# EasyEDA Pro project examples.epro, schematic Schematic6
Create Date: 2026-03-05; Page Name: P1; Project Name: EdaCopilotExamples; Schematic Name: Schematic6; Update Date: 2026-03-05; Company: EasyEDA.com; Page Size: A4; Version: V1.0
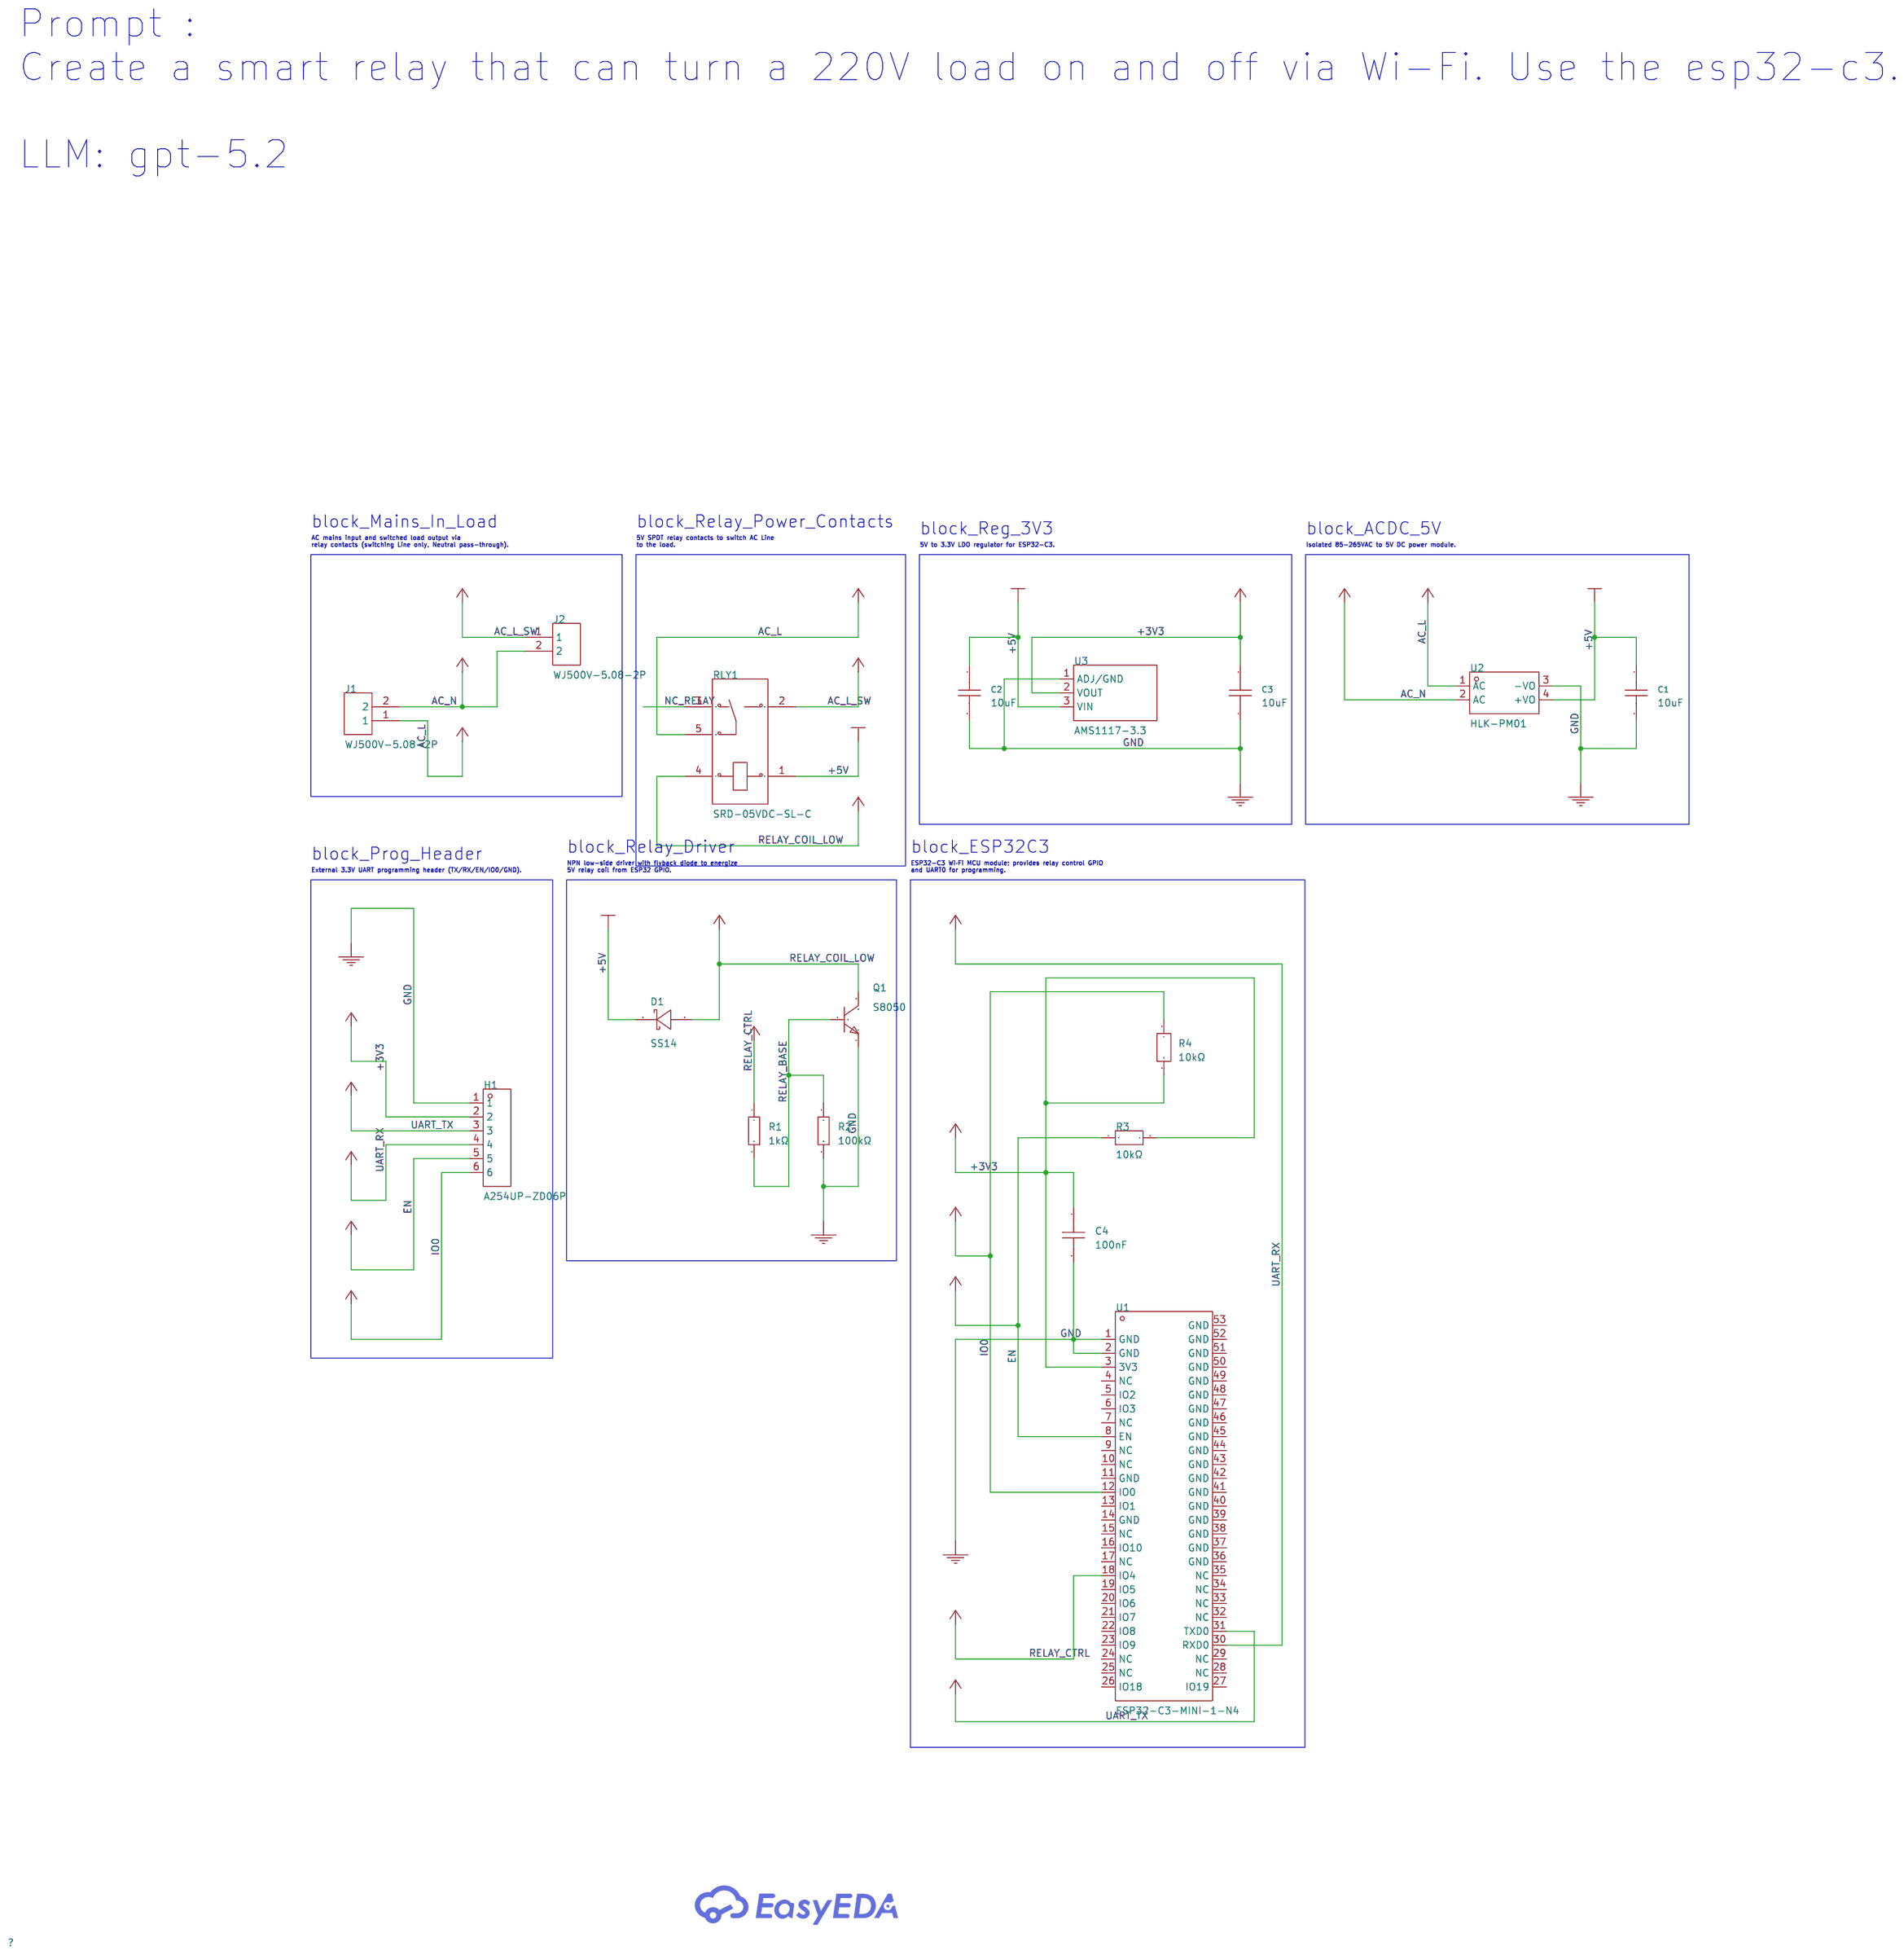
[diagram p5: schematic sheet]

## Parts
C1  10uF  [C0603]
C2  10uF  [C0603]
C3  10uF  [C0603]
C4  100nF  [C0402]
D1  SS14  [SMA_L4.3-W2.6-LS5.1-RD]
H1  A254UP-ZD06P  [HDR-TH_6P-P2.54-V-M]
J1  WJ500V-5.08-2P  [CONN-TH_2P-P5.00_WJ500V-5.08-2P]
J2  WJ500V-5.08-2P  [CONN-TH_2P-P5.00_WJ500V-5.08-2P]
Q1  S8050  [SOT-23-3_L2.9-W1.6-P1.90-LS2.8-BR]
R1  1kΩ  [R0603]
R2  100kΩ  [R0402]
R3  10kΩ  [R0603]
R4  10kΩ  [R0603]
RLY1  SRD-05VDC-SL-C  [RELAY-TH_SRD-XXVDC-XL-C]
U1  ESP32-C3-MINI-1-N4  [WIFIM-SMD_ESP32-C3-MINI-1]
U2  HLK-PM01  [PWRM-TH_HLK-PM01]
U3  AMS1117-3.3  [SOT-89-3_L4.5-W2.5-P1.50-LS4.2-BR]

## Library data of the parts
C1-C3 = CL10A106MA8NRNC: Capacitance:10uF Tolerance:±20% Tolerance:±20% Voltage Rating:25V Temperature Coefficient:X5R; LCSC Part Name: 10uF ±20% 25V; Supplier Part: C96446; Manufacturer: SAMSUNG(三星); Supplier Footprint: 0603; JLCPCB Part Class: Basic Part; Datasheet: https://item.szlcsc.com/datasheet/CL10A106MA8NRNC/97651.html; Supplier: LCSC; Tolerance: ±20%; Voltage Rating: 25V; Temperature Coefficient: X5R; supplier: LCSC; supplierId: C96446
C4 = CL05B104KB54PNC: Capacitance:100nF Tolerance:±10% Tolerance:±10% Voltage Rating:50V Temperature Coefficient:X7R; LCSC Part Name: 100nF ±10% 50V; Supplier Part: C307331; Manufacturer: SAMSUNG(三星); Supplier Footprint: 0402; JLCPCB Part Class: Basic Part; Datasheet: https://item.szlcsc.com/datasheet/CL05B104KB54PNC/291005.html; Supplier: LCSC; Tolerance: ±10%; Voltage Rating: 50V; Temperature Coefficient: X7R; supplier: LCSC; supplierId: C307331
D1 = SS14_C2986110: Diode Configuration:Independent Voltage - Forward(Vf@If):550mV@1A Voltage - DC Reverse(Vr):40V Current - Rectified:1A Reverse Leakage Current (Ir):200uA Operating Junction Temperature Range:-65℃~+125℃ Operating Junction Temperature Range:-65℃~+125℃ Non-Re; LCSC Part Name: 电压:40V 电流:1A; Supplier Part: C2986110; Manufacturer: GOODWORK(固得沃克); Supplier Footprint: SMA(DO-214AC); JLCPCB Part Class: Extended Part; Datasheet: https://item.szlcsc.com/datasheet/SS14/3432808.html; Supplier: LCSC; Diode Configuration: Independent; Voltage - Forward(Vf@If): 550mV@1A; Voltage - DC Reverse(Vr): 40V; Current - Rectified: 1A; Reverse Leakage Current (Ir): 200uA; Operating Junction Temperature Range: -65℃~+125℃; Non-Repetitive Peak Forward Surge Current: 30A; supplier: LCSC; supplierId: C2986110
H1 = A254UP-ZD06P: Pin Structure:1x6P Pitch:2.54mm Row Spacing:- Circluar Pins/Square Pins:Pin Header Mounting Type:Through Hole Number of Rows:1 Number of Pins:6P Current Rating:3A Length of Mating Pin:6mm Insulation Height:2.5mm Contact Material:Brass Contact Plating:Gold; LCSC Part Name: 1x6P 间距:2.54mm 方针 直插; Supplier Part: C41413835; Manufacturer: BXCONN(宝讯); Supplier Footprint: 插件,P=2.54mm; JLCPCB Part Class: Extended Part; Datasheet: https://item.szlcsc.com/datasheet/A254UP-ZD06P/43230042.html; Supplier: LCSC; Pin Structure: 1x6P; Pitch: 2.54mm; Circluar Pins/Square Pins: Pin Header; Mounting Type: Through Hole; Number of Rows: 1; Number of Pins: 6P; Current Rating: 3A; Length of Mating Pin: 6mm; Insulation Height: 2.5mm; Contact Material: Brass; Contact Plating: Gold; Operating Temperature: -40℃~+105℃; Color: Black; supplier: LCSC; supplierId: C41413835
J1 J2 = WJ500V-5.08-2P: Structure:1x2P Pitch:5.08mm Color:Green Mounting Style:Direct Insert Current Rating (Max):18A Voltage Rating (Max):250V Number of Pins:2P Number of Rows:1 Wire Gauge - AWG:14~30 Wire Gauge - AWG:14~30 Wire Gauge - mm2:2.5 Wire Gauge - mm2:2.5 Number of PI; LCSC Part Name: 1x2P 5.08mm 直插 排数:1 每排P数:2; Supplier Part: C8465; Manufacturer: KANGNEX(康奈克斯电气); Supplier Footprint: 插件,P=5.08mm; JLCPCB Part Class: Extended Part; Datasheet: https://atta.szlcsc.com/upload/public/pdf/source/20191225/C8465_02D34CE5B5B4A53DF5891601D97FA9F4.pdf; Supplier: LCSC; Structure: 1x2P; Pitch: 5.08mm; Color: Green; Mounting Style: Direct Insert; Current Rating (Max): 18A; Voltage Rating (Max): 250V; Number of Pins: 2P; Number of Rows: 1; Wire Gauge - AWG: 14~30; Wire Gauge - mm2: 2.5; Number of PINs Per Row: 2; Operating Temperature Range: -40℃~+105℃; Screw Specification: M2.5; supplier: LCSC; supplierId: C8465
Q1 = S8050_C7603172: type:NPN Current - Collector(Ic):500mA Collector - Emitter Voltage VCEO:25V Pd - Power Dissipation:300mW DC Current Gain:80@50mA,1V DC Current Gain:80@50mA,1V Transition frequency(fT):- Current - Collector Cutoff:1uA Vce Saturation(VCE(sat)):500mV Operati; LCSC Part Name: NPN 电流:500mA 电压:25V; Supplier Part: C7603172; Manufacturer: KUU; Supplier Footprint: SOT-23; JLCPCB Part Class: Extended Part; Datasheet: https://item.szlcsc.com/datasheet/S8050/8728666.html; Supplier: LCSC; type: NPN; Current - Collector(Ic): 500mA; Collector - Emitter Voltage VCEO: 25V; Pd - Power Dissipation: 300mW; DC Current Gain: 80@50mA,1V; Current - Collector Cutoff: 1uA; Vce Saturation(VCE(sat)): 500mV; Emitter-Base Voltage(Vebo): 5V; supplier: LCSC; supplierId: C7603172
R1 = RC0603FR-071KL: Type:Thick Film Resistor Resistance:1kΩ Tolerance:±1% Tolerance:±1% Power(Watts):100mW Voltage-Supply(Max):75V Temperature Coefficient:±100ppm/℃ Temperature Coefficient:±100ppm/℃ Operating Temperature:-55℃~+155℃ Operating Temperature:-55℃~+155℃; LCSC Part Name: 厚膜电阻 1kΩ ±1% 100mW; Supplier Part: C22548; Manufacturer: YAGEO(国巨); Supplier Footprint: 0603; JLCPCB Part Class: Extended Part; Datasheet: https://item.szlcsc.com/datasheet/RC0603FR-071KL/23274.html; Supplier: LCSC; Type: Thick Film Resistor; Tolerance: ±1%; Power(Watts): 100mW; Voltage-Supply(Max): 75V; Temperature Coefficient: ±100ppm/℃; Operating Temperature: -55℃~+155℃; supplier: LCSC; supplierId: C22548
R2 = RC0402FR-07100KL: Type:Thick Film Resistor Resistance:100kΩ Tolerance:±1% Tolerance:±1% Power(Watts):62.5mW Voltage-Supply(Max):50V Temperature Coefficient:±100ppm/℃ Temperature Coefficient:±100ppm/℃ Operating Temperature:-55℃~+155℃ Operating Temperature:-55℃~+155℃; LCSC Part Name: 厚膜电阻 100kΩ ±1% 62.5mW; Supplier Part: C60491; Manufacturer: YAGEO(国巨); Supplier Footprint: 0402; JLCPCB Part Class: Extended Part; Datasheet: https://item.szlcsc.com/datasheet/RC0402FR-07100KL/61543.html; Supplier: LCSC; Type: Thick Film Resistor; Tolerance: ±1%; Power(Watts): 62.5mW; Voltage-Supply(Max): 50V; Temperature Coefficient: ±100ppm/℃; Operating Temperature: -55℃~+155℃; supplier: LCSC; supplierId: C60491
R3 R4 = FRC0603J103 TS: Type:Thick Film Resistor Resistance:10kΩ Tolerance:±5% Tolerance:±5% Power(Watts):100mW Voltage-Supply(Max):75V Temperature Coefficient:±100ppm/℃ Temperature Coefficient:±100ppm/℃ Operating Temperature:-55℃~+155℃ Operating Temperature:-55℃~+155℃; LCSC Part Name: 10kΩ ±5% 100mW 厚膜电阻; Supplier Part: C2930027; Manufacturer: FOJAN(富捷); Supplier Footprint: 0603; JLCPCB Part Class: Extended Part; Datasheet: https://item.szlcsc.com/datasheet/FRC0603J103%2520TS/3266960.html; Supplier: LCSC; Type: Thick Film Resistor; Tolerance: ±5%; Power(Watts): 100mW; Voltage-Supply(Max): 75V; Temperature Coefficient: ±100ppm/℃; Operating Temperature: -55℃~+155℃; supplier: LCSC; supplierId: C2930027
RLY1 = SRD-05VDC-SL-C: Coil Voltage:5V Contact Form:1 Form C: 1C (SPDT-CO) Number of Pins:5 Contact Rating:- Switching Voltage(Max):250V@AC Coil Rated Power:360mW Switching Current(Max):15A Coil Type:Non-Polarized - Single Coil Coil Resistance:70Ω Contact Resistance:100mΩ Opera; LCSC Part Name: 蓝色 单组转换型继电器; Supplier Part: C35449; Manufacturer: 松乐; Supplier Footprint: 插件,15.6x19.2mm; JLCPCB Part Class: Extended Part; Datasheet: https://item.szlcsc.com/datasheet/SRD-05VDC-SL-C/36422.html; Supplier: LCSC; Coil Voltage: 5V; Contact Form: 1 Form C: 1C (SPDT-CO); Number of Pins: 5; Switching Voltage(Max): 250V@AC; Coil Rated Power: 360mW; Switching Current(Max): 15A; Coil Type: Non-Polarized - Single Coil; Coil Resistance: 70Ω; Contact Resistance: 100mΩ; Operate Time: 10ms; Release Time: 10ms; supplier: LCSC; supplierId: C35449
U1 = ESP32-C3-MINI-1-N4: Model:Transceiver Output Power(Max):20.5dBm Output Power(Max):20.5dBm Interface Type:SPI；UART；I2S；I2C；USB Voltage - Supply:3V~3.6V Voltage - Supply:3V~3.6V Antenna Type:On-board PCB Antenna Receive  Current:84mA Send  Current:350mA Sensitivity:-98dBm Sens; LCSC Part Name: 支持2.4GHz Wi-Fi和蓝牙5的小尺寸模组; Supplier Part: C2838502; Manufacturer: ESPRESSIF(乐鑫); Supplier Footprint: SMD,16.6x13.2mm; JLCPCB Part Class: Extended Part; Datasheet: https://item.szlcsc.com/datasheet/ESP32-C3-MINI-1-N4/3013227.html; Supplier: LCSC; Model: Transceiver; Output Power(Max): 20.5dBm; Interface Type: SPI；UART；I2S；I2C；USB; Voltage - Supply: 3V~3.6V; Antenna Type: On-board PCB Antenna; Receive  Current: 84mA; Send  Current: 350mA; Sensitivity: -98dBm; Operating Temperature: -40℃~+85℃; supplier: LCSC; supplierId: C2838502
U2 = HLK-PM01: Conversion Type:AC-DC Voltage - Input(AC):85VAC~265VAC Voltage - Input(AC):85VAC~265VAC Output Voltage:5V Output Voltage:5V Output Voltage Accuracy:±0.2% Output Voltage Accuracy:±0.2% Output Current(Max):700mA Output Current(Max):700mA Output Power:3W Qui; LCSC Part Name: 3W超小型系列AC-DC模块电源; Supplier Part: C209903; Manufacturer: HI-LINK(海凌科); Supplier Footprint: DIP,34x24mm; JLCPCB Part Class: Extended Part; Datasheet: https://item.szlcsc.com/datasheet/HLK-PM01/210981.html; Supplier: LCSC; Conversion Type: AC-DC; Voltage - Input(AC): 85VAC~265VAC; Output Voltage: 5V; Output Voltage Accuracy: ±0.2%; Output Current(Max): 700mA; Output Power: 3W; Quiescent Dissipation: 0.1W; Conversion Efficiency: 73%; Ripple Noise: 100mVp-p; Features: Over Current Protection；Short Circuit Protection; Isolation Voltage(Vrms): 3kV; Length: 34mm; Width: 20mm; Height: 15mm; supplier: LCSC; supplierId: C209903
U3 = AMS1117-3.3_C6067465: Output Type:Fixed Voltage - Supply:18V Output Voltage:3.3V Output Voltage:3.3V Output Current:1A Power Supply Rejection Ratio (PSRR):70dB@(120Hz) standby current:3mA Noise:0.003%Vout Features:Over Temperature Protection Operating Temperature:-40℃~+125℃@(T; LCSC Part Name: 线性稳压器 18V 1A; Supplier Part: C6067465; Manufacturer: GOODWORK(固得沃克); Supplier Footprint: SOT-89; JLCPCB Part Class: Extended Part; Datasheet: https://item.szlcsc.com/datasheet/AMS1117-3.3/7006989.html; Supplier: LCSC; Output Type: Fixed; Voltage - Supply: 18V; Output Voltage: 3.3V; Output Current: 1A; Power Supply Rejection Ratio (PSRR): 70dB@(120Hz); standby current: 3mA; Noise: 0.003%Vout; Features: Over Temperature Protection; Operating Temperature: -40℃~+125℃@(Tj); Output Configuration: Positive; Number of Outputs: 1; supplier: LCSC; supplierId: C6067465

## Nets
+3V3: C3.1 C4.1 H1.2 R3.2 R4.2 U1.3(3V3) U3.2(VOUT)
+5V: C1.1 C2.1 D1.1(K) RLY1.1 U2.4(+VO) U3.3(VIN)
GND: C1.2 C2.2 C3.2 C4.2 H1.1 Q1.2(E) R2.2 U1.1(GND) U1.2(GND) U2.3(-VO) U3.1(ADJ/GND)
AC_L: J1.1 RLY1.5 U2.1(AC)
AC_L_SW: J2.1 RLY1.2
AC_N: J1.2 J2.2 U2.2(AC)
EN: H1.5 R3.1 U1.8(EN)
IO0: H1.6 R4.1 U1.12(IO0)
NC_RELAY: RLY1.3
RELAY_BASE: Q1.1(B) R1.2 R2.1
RELAY_COIL_LOW: D1.2(A) Q1.3(C) RLY1.4
RELAY_CTRL: R1.1 U1.18(IO4)
UART_RX: H1.4 U1.30(RXD0)
UART_TX: H1.3 U1.31(TXD0)

Not connected (* = marked no-connect by the designer): U1 4(NC) 5(IO2) 6(IO3) 7(NC) 9(NC) 10(NC) 11(GND) 13(IO1) 14(GND) 15(NC) 16(IO10) 17(NC) 19(IO5) 20(IO6) 21(IO7) 22(IO8) 23(IO9) 24(NC) 25(NC) 26(IO18) 27(IO19) 28(NC) 29(NC) 32(NC) 33(NC) 34(NC) 35(NC) 36(GND) 37(GND) 38(GND) 39(GND) 40(GND) 41(GND) 42(GND) 43(GND) 44(GND) 45(GND) 46(GND) 47(GND) 48(GND) 49(GND) 50(GND) 51(GND) 52(GND) 53(GND)

## Notes on the sheet
- Prompt :
  Create a smart relay that can turn a 220V load on and off via Wi-Fi. Use the esp32-c3.
  LLM: gpt-5.2
- block_Mains_In_Load
- block_Relay_Power_Contacts
- AC mains input and switched load output via
  relay contacts (switching Line only, Neutral pass-through).
- 5V SPDT relay contacts to switch AC Line
  to the load.
- block_Reg_3V3
- block_ACDC_5V
- 5V to 3.3V LDO regulator for ESP32-C3.
- Isolated 85-265VAC to 5V DC power module.
- block_Prog_Header
- block_Relay_Driver
- block_ESP32C3
- NPN low-side driver with flyback diode to energize
  5V relay coil from ESP32 GPIO.
- ESP32-C3 Wi‑Fi MCU module; provides relay control GPIO
  and UART0 for programming.
- External 3.3V UART programming header (TX/RX/EN/IO0/GND).
